# EAGLE design motor_module_dev (EAGLE 6.5.0)
AUTHOR: Austin Buchan; DESIGN_NAME: MotorModule; REVISION: 0.0; YEAR: 2014

## Sheet 1 of 3: Power
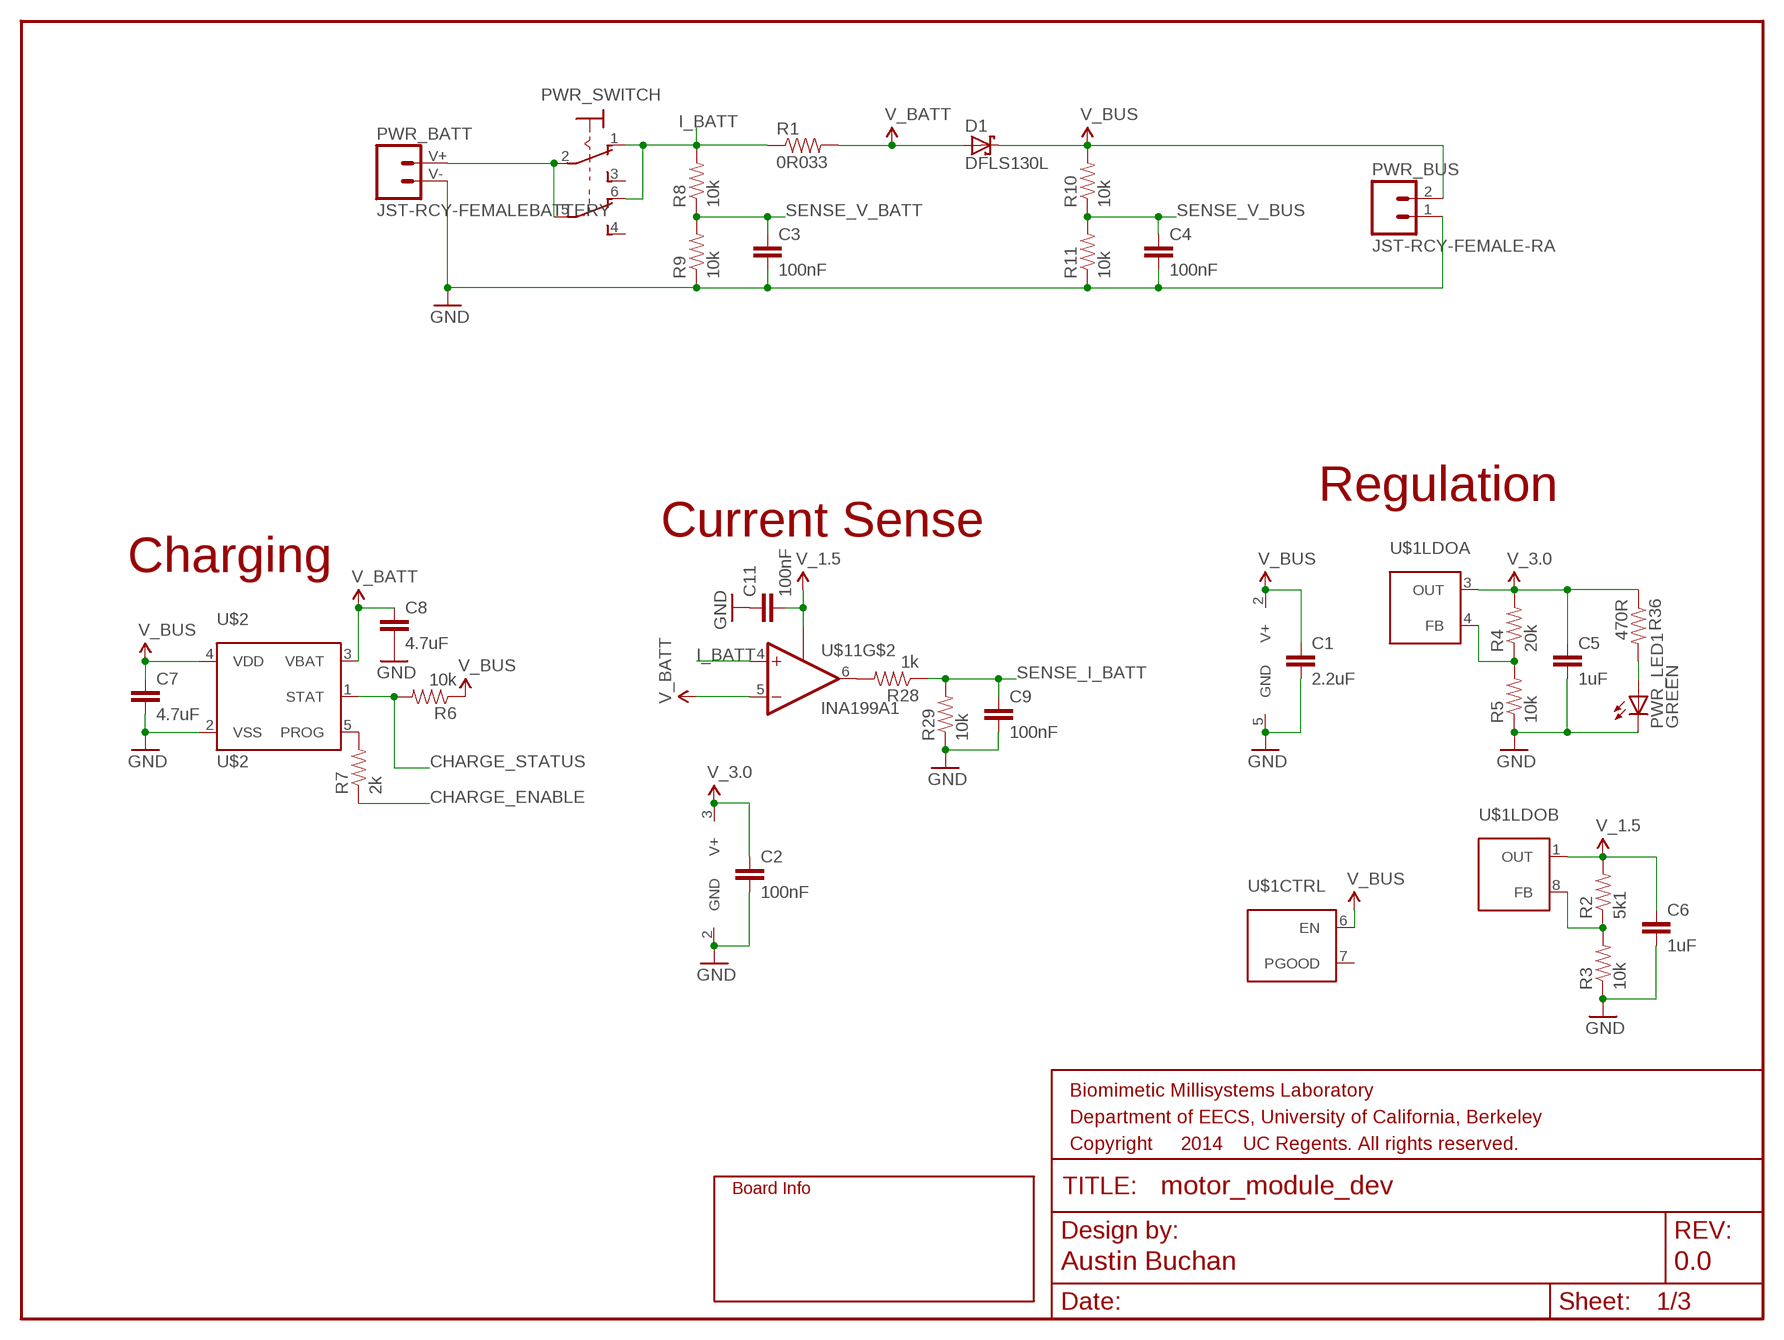
[diagram p0: schematic, sheet 1]
FRAME1 (FRAME-LETTER): SHEET_NAME: Power

### Parts
C1  2.2uF  CAP0402-CAP  [0402-CAP]
C2  100nF  CAP0402-CAP  [0402-CAP]
C3  100nF  CAP0402-CAP  [0402-CAP]
C4  100nF  CAP0402-CAP  [0402-CAP]
C5  1uF  CAP0402-CAP  [0402-CAP]
C6  1uF  CAP0402-CAP  [0402-CAP]
C7  4.7uF  CAP0402-CAP  [0402-CAP]
C8  4.7uF  CAP0402-CAP  [0402-CAP]
C9  100nF  CAP0402-CAP  [0402-CAP]
C11  100nF  CAP0402-CAP  [0402-CAP]
D1  DFLS130L  [POWERDI123]
PWR_BATT  JST-RCY-FEMALEBATTERY  [TP_LIPO_160MAH]
PWR_BUS  JST-RCY-FEMALE-RA  [JST_2_FEMALE]
PWR_LED1  GREEN  LED0603  [LED-0603]
PWR_SWITCH  JS202011SCQN  [JS202011SCQN]
R1  0R033  RESISTOR0603-RES  [0603-RES]
R2  5k1  RESISTOR0402-RES  [0402-RES]
R3  10k  RESISTOR0402-RES  [0402-RES]
R4  20k  RESISTOR0402-RES  [0402-RES]
R5  10k  RESISTOR0402-RES  [0402-RES]
R6  10k  RESISTOR0402-RES  [0402-RES]
R7  2k  RESISTOR0402-RES  [0402-RES]
R8  10k  RESISTOR0402-RES  [0402-RES]
R9  10k  RESISTOR0402-RES  [0402-RES]
R10  10k  RESISTOR0402-RES  [0402-RES]
R11  10k  RESISTOR0402-RES  [0402-RES]
R28  1k  RESISTOR0402-RES  [0402-RES]
R29  10k  RESISTOR0402-RES  [0402-RES]
R36  470R  RESISTOR0402-RES  [0402-RES]
U$1  SC560C  [MLPQ-UT8]
U$2  MCP73831T  [SOT23-5]
U$11  INA199A1  [SC70-6]
U$31  INFO  [INFO]

### Nets
CHARGE_ENABLE: R7.1 ; also sheet 3
CHARGE_STATUS: R6.2 U$2.1(STAT) ; also sheet 3
GND: C1.2 C2.2 C3.2 C4.2 C5.2 C6.2 C7.2 C8.2 C9.2 C11.1 PWR_BATT.V- PWR_BUS.1 PWR_LED1.C R3.1 R5.1 R9.1 R11.1 R29.1 U$1.5(GND) U$2.2(VSS) U$11.2(GND) ; also sheet 2,3
I_BATT: PWR_SWITCH.1(O) PWR_SWITCH.6(O) R1.1 R8.2 U$11.4(+IN)
N$1: PWR_BATT.V+ PWR_SWITCH.2(P) PWR_SWITCH.5(P)
N$2: R2.1 R3.2 U$1.8(LDOB:FB)
N$3: R4.1 R5.2 U$1.4(LDOA:FB)
N$4: R7.2 U$2.5(PROG)
N$6: R28.2 U$11.6(OUT)
N$7: PWR_LED1.A R36.2
SENSE_I_BATT: C9.1 R28.1 R29.2 ; also sheet 3
SENSE_V_BATT: C3.1 R8.1 R9.2 ; also sheet 3
SENSE_V_BUS: C4.1 R10.1 R11.2 ; also sheet 3
V_1.5: C6.1 C11.2 R2.2 U$1.1(LDOB:OUT) U$11.1(REF) ; also sheet 2
V_3.0: C2.1 C5.1 R4.2 R36.1 U$1.3(LDOA:OUT) U$11.3(V+) ; also sheet 2,3
V_BATT: C8.1 D1.A R1.2 U$2.3(VBAT) U$11.5(-IN) ; also sheet 2
V_BUS: C1.1 C7.1 D1.C PWR_BUS.2 R6.1 R10.2 U$1.2(V+) U$1.6(CTRL:EN) U$2.4(VDD) ; also sheet 3
Unconnected: PWR_SWITCH.3(S) PWR_SWITCH.4(S) U$1.7(CTRL:PGOOD)

### Notes on the sheet
- Regulation
- Current Sense
- Charging

## Sheet 2 of 3: Motor
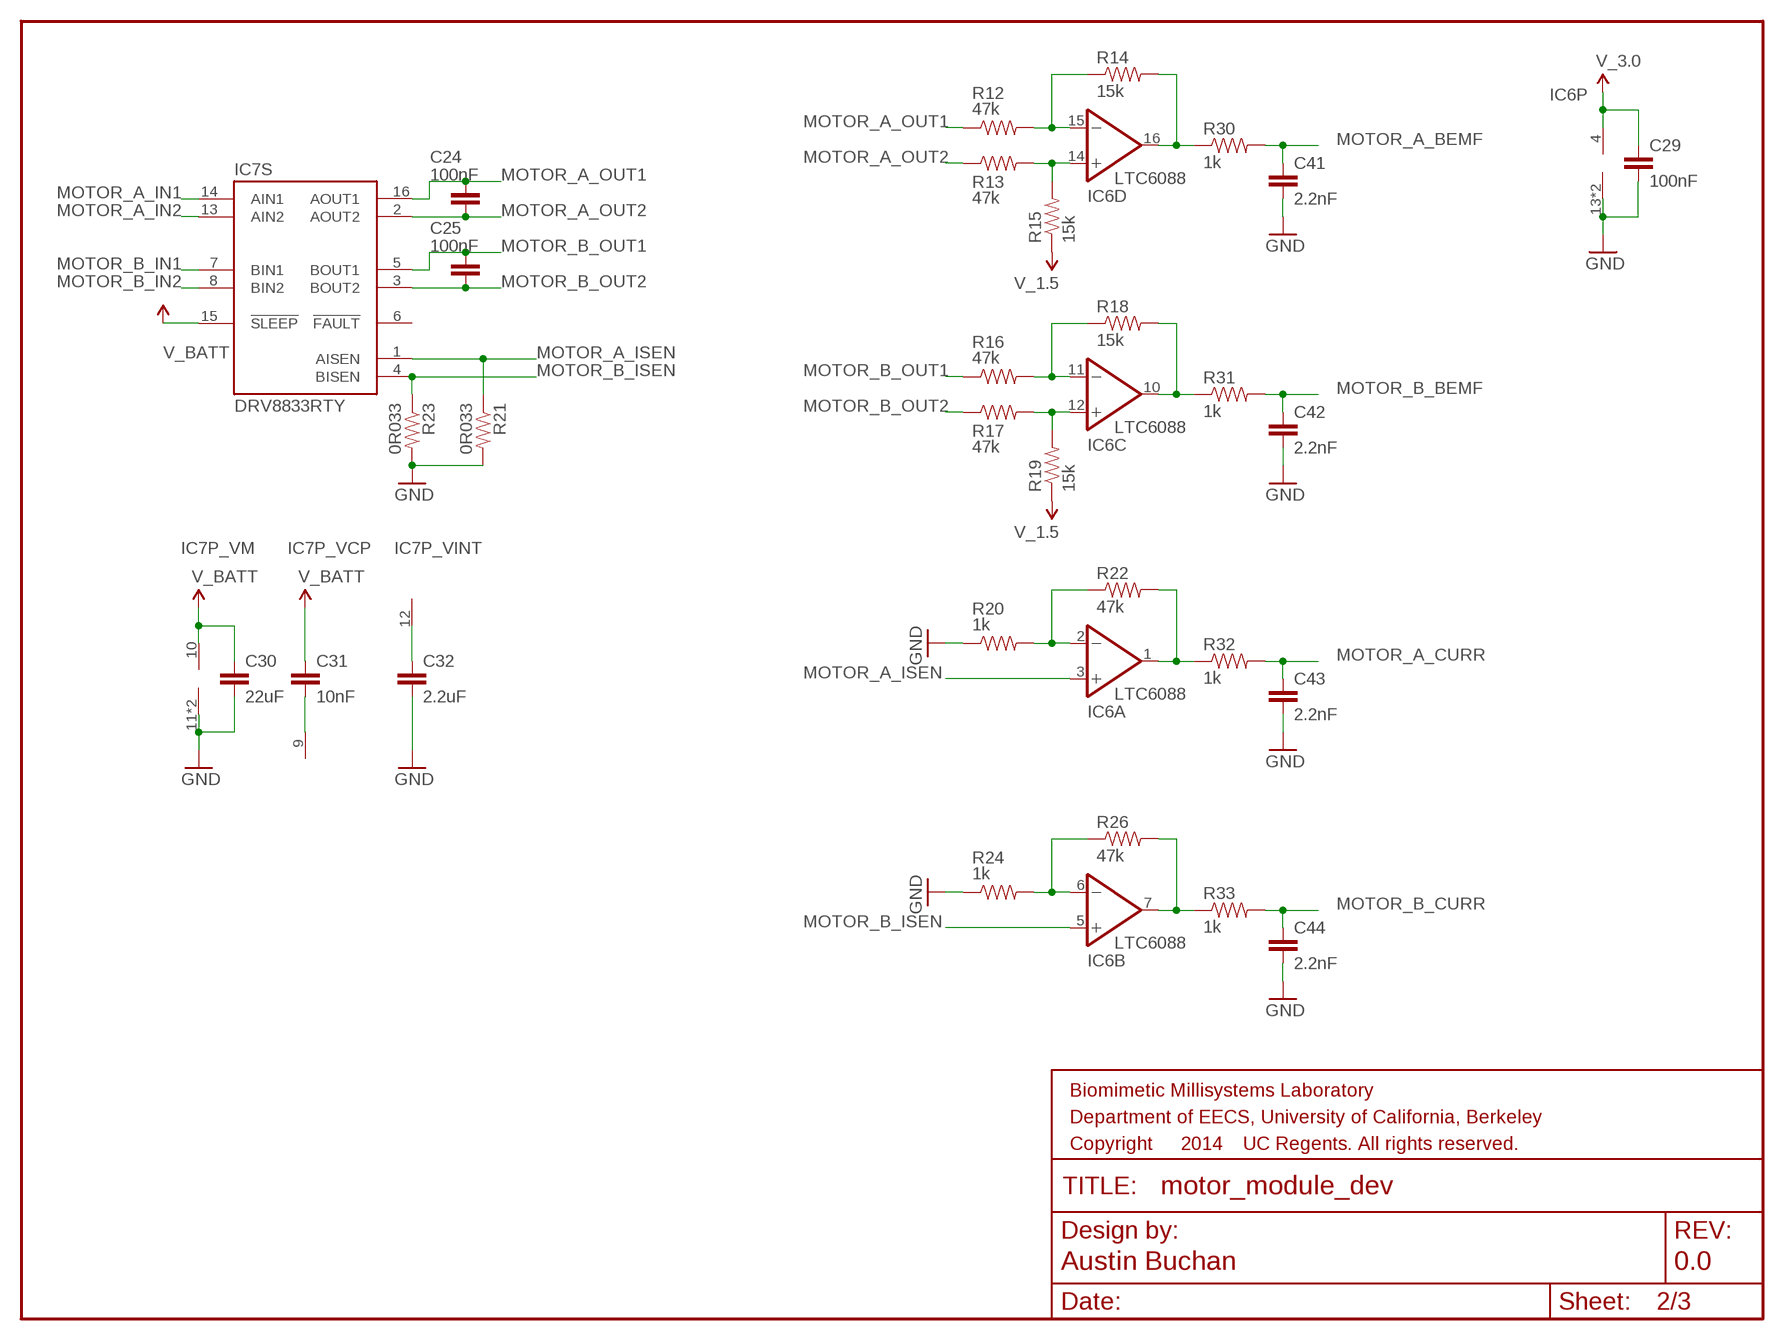
[diagram p1: schematic, sheet 2]
FRAME3 (FRAME-LETTER): SHEET_NAME: Motor

### Parts
C24  100nF  CAP0402-CAP  [0402-CAP]
C25  100nF  CAP0402-CAP  [0402-CAP]
C29  100nF  CAP0402-CAP  [0402-CAP]
C30  22uF  CAP0603-CAP  [0603-CAP]
C31  10nF  CAP0402-CAP  [0402-CAP]
C32  2.2uF  CAP0402-CAP  [0402-CAP]
C41  2.2nF  CAP0402-CAP  [0402-CAP]
C42  2.2nF  CAP0402-CAP  [0402-CAP]
C43  2.2nF  CAP0402-CAP  [0402-CAP]
C44  2.2nF  CAP0402-CAP  [0402-CAP]
IC6  LTC6088  [DFN-16]
IC7  DRV8833RTY  [S-PWQFN-N16]
R12  47k  RESISTOR0402-RES  [0402-RES]
R13  47k  RESISTOR0402-RES  [0402-RES]
R14  15k  RESISTOR0402-RES  [0402-RES]
R15  15k  RESISTOR0402-RES  [0402-RES]
R16  47k  RESISTOR0402-RES  [0402-RES]
R17  47k  RESISTOR0402-RES  [0402-RES]
R18  15k  RESISTOR0402-RES  [0402-RES]
R19  15k  RESISTOR0402-RES  [0402-RES]
R20  1k  RESISTOR0402-RES  [0402-RES]
R21  0R033  RESISTOR0603-RES  [0603-RES]
R22  47k  RESISTOR0402-RES  [0402-RES]
R23  0R033  RESISTOR0603-RES  [0603-RES]
R24  1k  RESISTOR0402-RES  [0402-RES]
R26  47k  RESISTOR0402-RES  [0402-RES]
R30  1k  RESISTOR0402-RES  [0402-RES]
R31  1k  RESISTOR0402-RES  [0402-RES]
R32  1k  RESISTOR0402-RES  [0402-RES]
R33  1k  RESISTOR0402-RES  [0402-RES]

### Nets
GND: C29.2 C30.2 C32.2 C41.2 C42.2 C43.2 C44.2 IC6.13(P:V-) IC6.PAD(P:V-) IC7.11(P_VM:V-) IC7.PPAD(P_VM:V-) R20.1 R21.2 R23.2 R24.1 ; also sheet 1,3
MOTOR_A_BEMF: C41.1 R30.2 ; also sheet 3
MOTOR_A_CURR: C43.1 R32.2 ; also sheet 3
MOTOR_A_IN1: IC7.14(S:AIN1) ; also sheet 3
MOTOR_A_IN2: IC7.13(S:AIN2) ; also sheet 3
MOTOR_A_ISEN: IC6.3(A:+IN) IC7.1(S:AISEN) R21.1
MOTOR_A_OUT1: C24.1 IC7.16(S:AOUT1) R12.1
MOTOR_A_OUT2: C24.2 IC7.2(S:AOUT2) R13.1
MOTOR_B_BEMF: C42.1 R31.2 ; also sheet 3
MOTOR_B_CURR: C44.1 R33.2 ; also sheet 3
MOTOR_B_IN1: IC7.7(S:BIN1) ; also sheet 3
MOTOR_B_IN2: IC7.8(S:BIN2) ; also sheet 3
MOTOR_B_ISEN: IC6.5(B:+IN) IC7.4(S:BISEN) R23.1
MOTOR_B_OUT1: C25.1 IC7.5(S:BOUT1) R16.1
MOTOR_B_OUT2: C25.2 IC7.3(S:BOUT2) R17.1
N$5: C31.2 IC7.9(P_VCP:V+)
N$18: C32.1 IC7.12(P_VINT:V-)
N$22: IC6.11(C:-IN) R16.2 R18.1
N$23: IC6.12(C:+IN) R17.2 R19.2
N$24: IC6.2(A:-IN) R20.2 R22.1
N$26: IC6.6(B:-IN) R24.2 R26.1
N$30: IC6.15(D:-IN) R12.2 R14.1
N$31: IC6.14(D:+IN) R13.2 R15.2
N$34: IC6.7(B:OUT) R26.2 R33.1
N$35: IC6.1(A:OUT) R22.2 R32.1
N$36: IC6.16(D:OUT) R14.2 R30.1
N$37: IC6.10(C:OUT) R18.2 R31.1
V_1.5: R15.1 R19.1 ; also sheet 1
V_3.0: C29.1 IC6.4(P:V+) ; also sheet 1,3
V_BATT: C30.1 C31.1 IC7.10(P_VM:V+) IC7.15(S:!SLEEP) ; also sheet 1
Unconnected: IC7.6(S:!FAULT)

## Sheet 3 of 3: Microcontroller
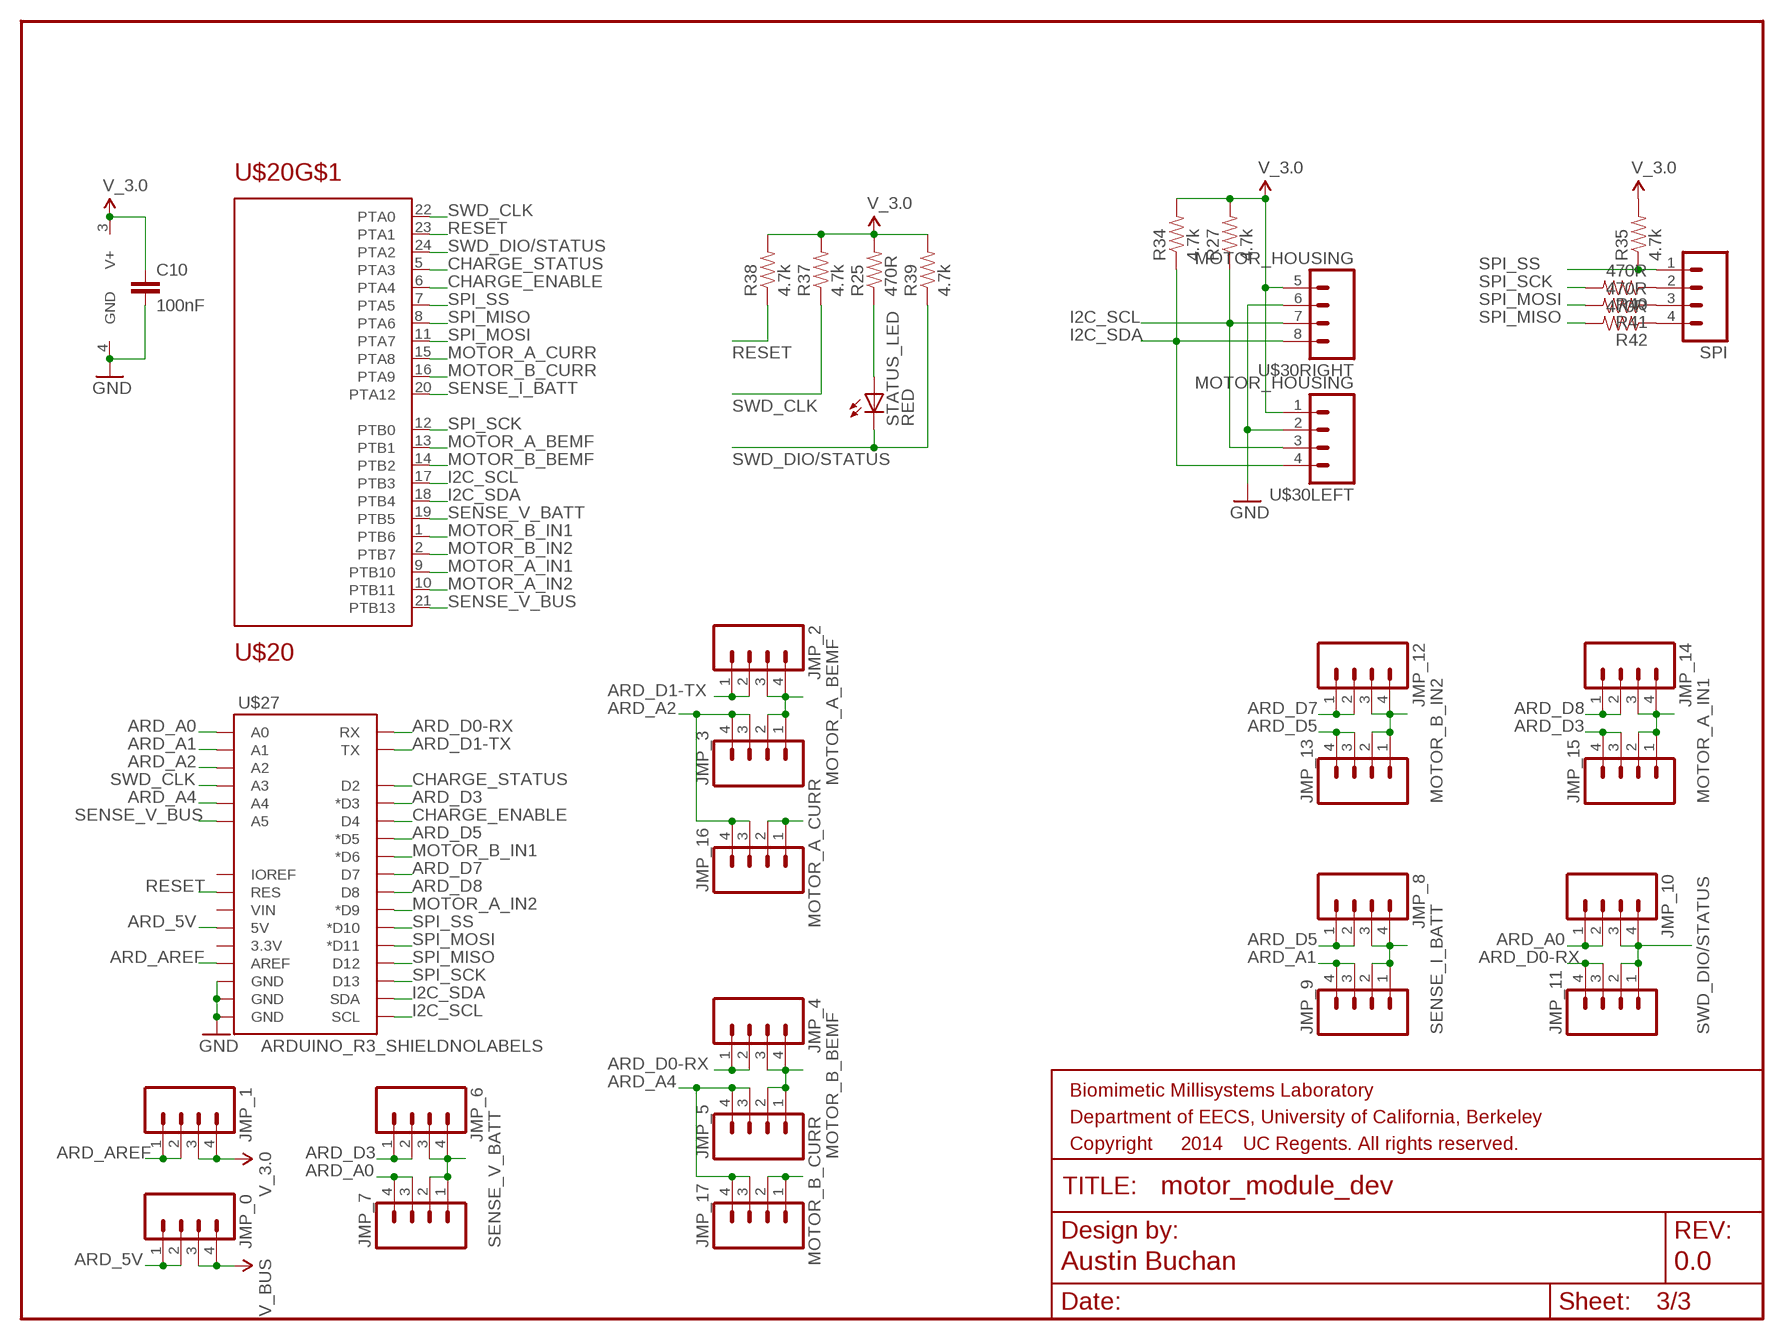
[diagram p2: schematic, sheet 3]

### Parts
C10  100nF  CAP0402-CAP  [0402-CAP]
JMP_0  M041X04_NO_SILK  [1X04_NO_SILK]
JMP_1  M041X04_NO_SILK  [1X04_NO_SILK]
JMP_2  M041X04_NO_SILK  [1X04_NO_SILK]
JMP_3  M041X04_NO_SILK  [1X04_NO_SILK]
JMP_4  M041X04_NO_SILK  [1X04_NO_SILK]
JMP_5  M041X04_NO_SILK  [1X04_NO_SILK]
JMP_6  M041X04_NO_SILK  [1X04_NO_SILK]
JMP_7  M041X04_NO_SILK  [1X04_NO_SILK]
JMP_8  M041X04_NO_SILK  [1X04_NO_SILK]
JMP_9  M041X04_NO_SILK  [1X04_NO_SILK]
JMP_10  M041X04_NO_SILK  [1X04_NO_SILK]
JMP_11  M041X04_NO_SILK  [1X04_NO_SILK]
JMP_12  M041X04_NO_SILK  [1X04_NO_SILK]
JMP_13  M041X04_NO_SILK  [1X04_NO_SILK]
JMP_14  M041X04_NO_SILK  [1X04_NO_SILK]
JMP_15  M041X04_NO_SILK  [1X04_NO_SILK]
JMP_16  M041X04_NO_SILK  [1X04_NO_SILK]
JMP_17  M041X04_NO_SILK  [1X04_NO_SILK]
R25  470R  RESISTOR0402-RES  [0402-RES]
R27  4.7k  RESISTOR0402-RES  [0402-RES]
R34  4.7k  RESISTOR0402-RES  [0402-RES]
R35  4.7k  RESISTOR0402-RES  [0402-RES]
R37  4.7k  RESISTOR0402-RES  [0402-RES]
R38  4.7k  RESISTOR0402-RES  [0402-RES]
R39  4.7k  RESISTOR0402-RES  [0402-RES]
R40  470R  RESISTOR0402-RES  [0402-RES]
R41  470R  RESISTOR0402-RES  [0402-RES]
R42  470R  RESISTOR0402-RES  [0402-RES]
SPI  M041X04_NO_SILK  [1X04_NO_SILK]
STATUS_LED  RED  LED0603  [LED-0603]
U$20  MKL05Z32VFK4  [QFN-24]
U$27  ARDUINO_R3_SHIELDNOLABELS  [UNO_R3_SHIELD_NOLABELS]
U$30  MOTOR_HOUSING  [MOTOR_HOUSING]

### Nets
ARD_5V: JMP_0.1 JMP_0.2 U$27.5V
ARD_A0: JMP_7.3 JMP_7.4 JMP_10.1 JMP_10.2 U$27.A0
ARD_A1: JMP_9.3 JMP_9.4 U$27.A1
ARD_A2: JMP_3.3 JMP_3.4 JMP_16.3 JMP_16.4 U$27.A2
ARD_A4: JMP_5.3 JMP_5.4 JMP_17.3 JMP_17.4 U$27.A4
ARD_AREF: JMP_1.1 JMP_1.2 U$27.AREF
ARD_D0-RX: JMP_4.1 JMP_4.2 JMP_11.3 JMP_11.4 U$27.RX
ARD_D1-TX: JMP_2.1 JMP_2.2 U$27.TX
ARD_D3: JMP_6.1 JMP_6.2 JMP_15.3 JMP_15.4 U$27.D3(*D3)
ARD_D5: JMP_8.1 JMP_8.2 JMP_13.3 JMP_13.4 U$27.D5(*D5)
ARD_D7: JMP_12.1 JMP_12.2 U$27.D7
ARD_D8: JMP_14.1 JMP_14.2 U$27.D8
CHARGE_ENABLE: U$20.6(PTA4) U$27.D4 ; also sheet 1
CHARGE_STATUS: U$20.5(PTA3) U$27.D2 ; also sheet 1
GND: C10.2 U$20.4(GND) U$27.GND@0(GND) U$27.GND@1(GND) U$27.GND@2(GND) U$30.2 U$30.6 ; also sheet 1,2
I2C_SCL: R27.1 U$20.17(PTB3) U$27.SCL U$30.3 U$30.7
I2C_SDA: R34.1 U$20.18(PTB4) U$27.SDA U$30.4 U$30.8
MOTOR_A_BEMF: JMP_2.3 JMP_2.4 JMP_3.1 JMP_3.2 U$20.13(PTB1) ; also sheet 2
MOTOR_A_CURR: JMP_16.1 JMP_16.2 U$20.15(PTA8) ; also sheet 2
MOTOR_A_IN1: JMP_14.3 JMP_14.4 JMP_15.1 JMP_15.2 U$20.9(PTB10) ; also sheet 2
MOTOR_A_IN2: U$20.10(PTB11) U$27.D9(*D9) ; also sheet 2
MOTOR_B_BEMF: JMP_4.3 JMP_4.4 JMP_5.1 JMP_5.2 U$20.14(PTB2) ; also sheet 2
MOTOR_B_CURR: JMP_17.1 JMP_17.2 U$20.16(PTA9) ; also sheet 2
MOTOR_B_IN1: U$20.1(PTB6) U$27.D6(*D6) ; also sheet 2
MOTOR_B_IN2: JMP_12.3 JMP_12.4 JMP_13.1 JMP_13.2 U$20.2(PTB7) ; also sheet 2
N$8: R25.1 STATUS_LED.A
N$9: R40.1 SPI.2
N$10: R41.1 SPI.3
N$11: R42.1 SPI.4
RESET: R38.1 U$20.23(PTA1) U$27.RES
SENSE_I_BATT: JMP_8.3 JMP_8.4 JMP_9.1 JMP_9.2 U$20.20(PTA12) ; also sheet 1
SENSE_V_BATT: JMP_6.3 JMP_6.4 JMP_7.1 JMP_7.2 U$20.19(PTB5) ; also sheet 1
SENSE_V_BUS: U$20.21(PTB13) U$27.A5 ; also sheet 1
SPI_MISO: R42.2 U$20.8(PTA6) U$27.D12
SPI_MOSI: R41.2 U$20.11(PTA7) U$27.D11(*D11)
SPI_SCK: R40.2 U$20.12(PTB0) U$27.D13
SPI_SS: R35.1 SPI.1 U$20.7(PTA5) U$27.D10(*D10)
SWD_CLK: R37.1 U$20.22(PTA0) U$27.A3
SWD_DIO/STATUS: JMP_10.3 JMP_10.4 JMP_11.1 JMP_11.2 R39.1 STATUS_LED.C U$20.24(PTA2)
V_3.0: C10.1 JMP_1.3 JMP_1.4 R25.2 R27.2 R34.2 R35.2 R37.2 R38.2 R39.2 U$20.3(V+) U$30.1 U$30.5 ; also sheet 1,2
V_BUS: JMP_0.3 JMP_0.4 ; also sheet 1
Unconnected: U$27.3.3V U$27.IOREF U$27.VIN

## Library data of the parts
C1 C7 C8 C30 = biomimetic:CAP: Capacitor Standard 0603 ceramic capacitor, and 0.1" leaded capacitor.; VOLTAGE: 10V
C2-C6 C9-C11 C29 C41-C44 = biomimetic:CAP: Capacitor Standard 0603 ceramic capacitor, and 0.1" leaded capacitor.; VOLTAGE: 6.3V
C24 C25 = biomimetic:CAP: Capacitor Standard 0603 ceramic capacitor, and 0.1" leaded capacitor.; TECHNOLOGY: CERAMIC; VOLTAGE: 10V
C31 = biomimetic:CAP: Capacitor Standard 0603 ceramic capacitor, and 0.1" leaded capacitor.; DIELECTRIC: X7R; TECHNOLOGY: CERAMIC; VOLTAGE: 16V
C32 = biomimetic:CAP: Capacitor Standard 0603 ceramic capacitor, and 0.1" leaded capacitor.; TECHNOLOGY: CERAMIC; VOLTAGE: 6.3V
D1 = modular_robotics:DFLS130L
IC6 = biomimetic:LTC6088: 14MHz, Rail-to-Rail Output, 12nV/Hz, 1.1mA Op Amp Source: http://cds.linear.com/docs/Datasheet/60878fb.pdf Digi-Key P/N: LTC6088HDHC#PBF-ND
IC7 = biomimetic:DRV8833: TI DRV8833 1.5A Dual H-Bridge Motor Driver IC Digi-Key P/N: 296-29513-6-ND
JMP_0 JMP_1-JMP_17 SPI = modular_robotics:M04: Header 4 Standard 4-pin 0.1" header. Use with straight break away headers (SKU : PRT-00116), right angle break away headers (PRT-00553), swiss pins (PRT-00743), machine pins (PRT-00117), and female headers (PRT-00115). Molex polarized connector foot print use with SKU : PRT-08231 with associated crimp pins and housings. 1MM SMD Version SKU: PRT-10208
PWR_BATT PWR_BUS = modular_robotics:JST-RCY-FEMALE
PWR_LED1 STATUS_LED = biomimetic:LED: LEDs Standard schematic elements and footprints for 5mm, 3mm, 1206, and 0603 sized LEDs. 5mm - Spark Fun Electronics SKU : COM-00529 (and others)
PWR_SWITCH = modular_robotics:JS202011SCQN
R1-R11 R21 R23 R25 R27-R42 = biomimetic:RESISTOR: Resistor Basic schematic elements and footprints for 0603, 1206, and PTH resistors.
R12-R20 R22 R24 R26 = biomimetic:RESISTOR: Resistor Basic schematic elements and footprints for 0603, 1206, and PTH resistors.; TOLERANCE: 1%
U$1 = modular_robotics:SC560C
U$2 = modular_robotics:MCP73831T
U$11 = modular_robotics:INA199A1
U$20 = modular_robotics:MKL05Z32VFK4
U$27 = SparkFun-Boards:ARDUINO_R3_SHIELD: Shield form compatible with the Arduino Uno R3.
U$30 = modular_robotics:MOTOR_HOUSING
U$31 = modular_robotics:INFO; AUTHOR: Austin Buchan; DATE: Feb. 2014; DESIGN: Motor Control Dev; ORGANIZATION: UC Berkeley Biomimetic Millisystems Lab; REVISION: r0.1

## Board
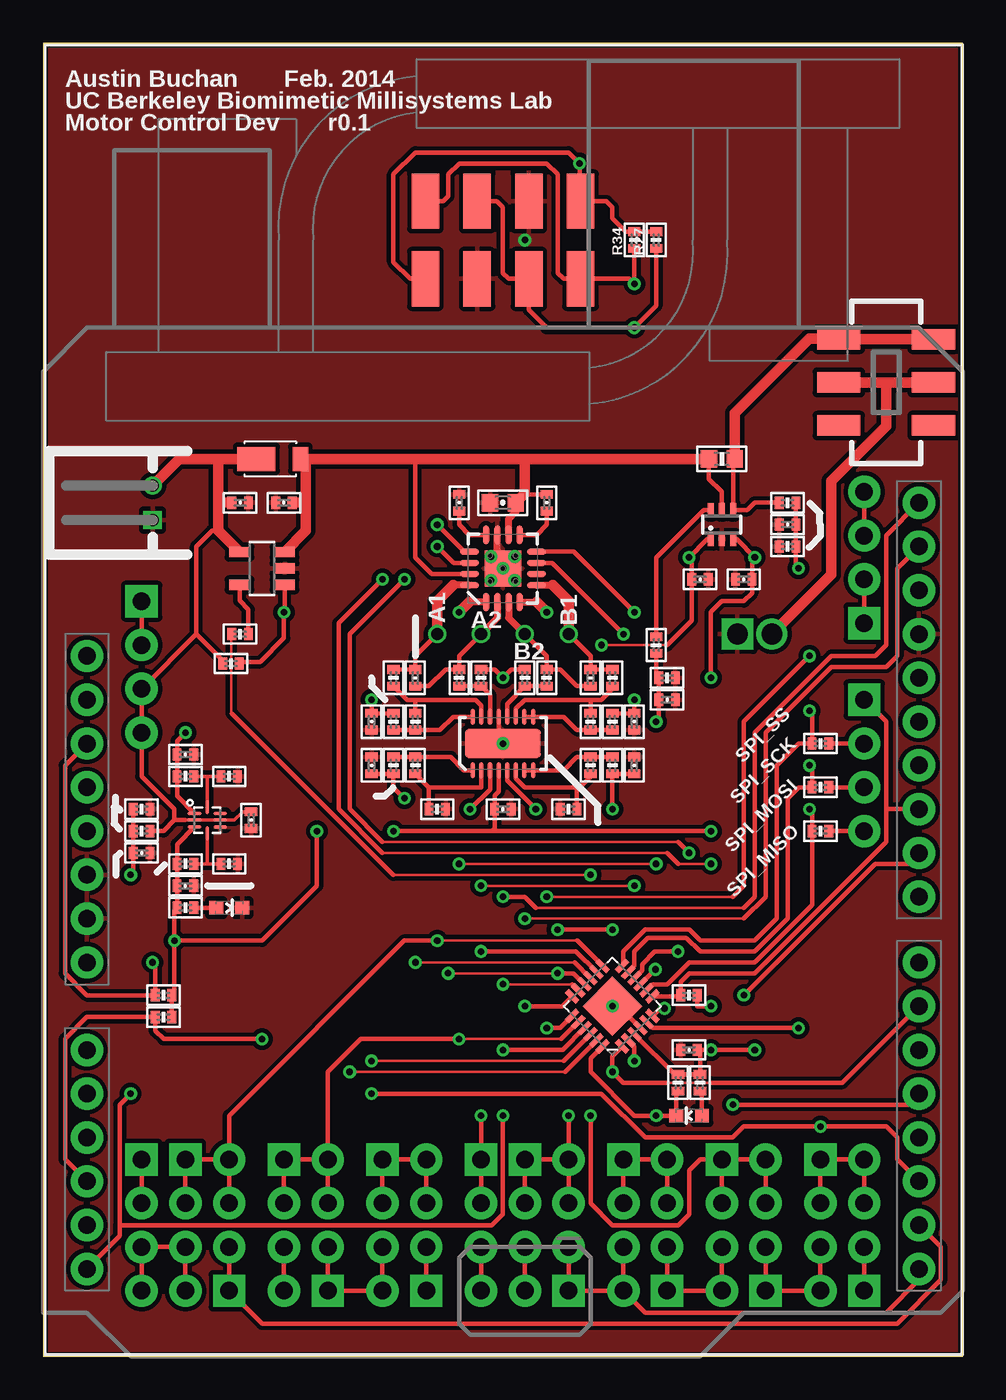
[diagram p3: board, top side]
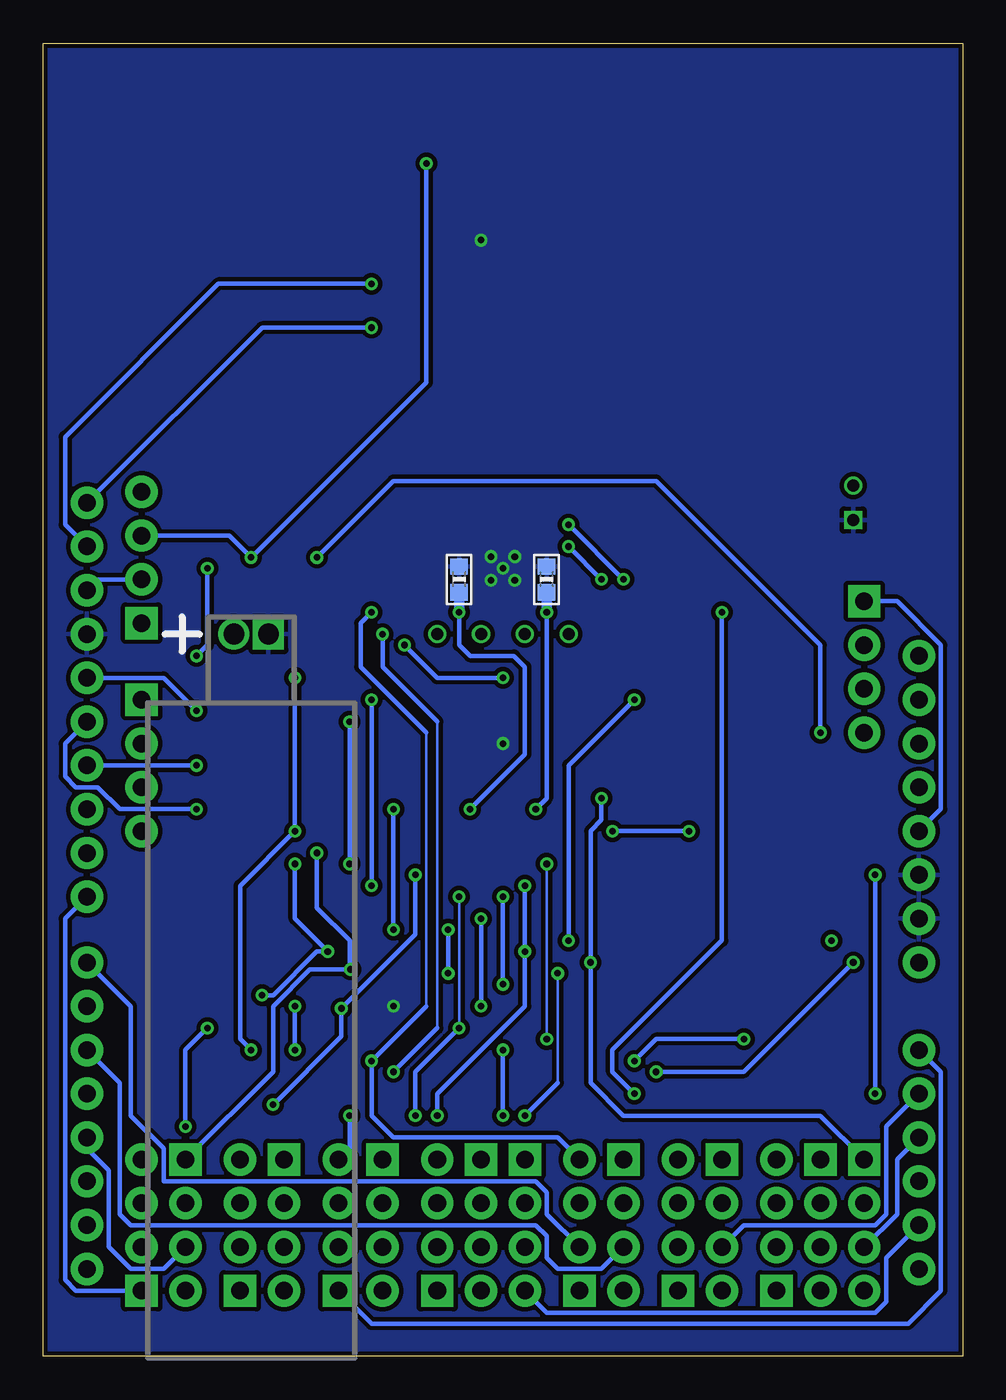
[diagram p4: board, bottom side, seen from below]

Size 53.34 x 76.2 mm. Coordinates in mm from the lower left corner, seen from the top.
Outline: 0,0 53.34,0 53.34,76.2 0,76.2 0,0
Copper layers (1*2+3*16): Top 2mil / dielectric 9mil / Route2 2mil / dielectric 40mil / Route3 2mil / dielectric 9mil / Bottom 2mil
Design rules "advancedcircuits-66each-biomimetic": minimum track width 6mil, minimum drill 15mil, track to track 6mil, track to pad 6mil, pad to pad 6mil, via to via 6mil, smd to smd 6mil, copper to edge 10mil, drill to drill 7mil, minimum pad ring 7mil, minimum via ring 7mil, stop-mask expansion 3mil, vias tented up to drill 0mil, thermal gap 10mil

### Footprints (pad centres in the part's own frame; a part is rotated, then mirrored left to right if it is on the bottom)
0402-CAP = smd 0.508 x 0.711: 1 -0.483,0; 2 0.483,0
0603-CAP = smd 0.94 x 1.016: 1 -0.749,0; 2 0.749,0
POWERDI123 = smd 0.9 x 1.4: A 0.95,0 | smd 2.2 x 1.4: C -1.6,0
DFN-16 = smd 0.25 x 0.9: 1 -1.75,-1.55; 2 -1.25,-1.55; 3 -0.75,-1.55; 4 -0.25,-1.55; 5 0.25,-1.55; 6 0.75,-1.55; 7 1.25,-1.55; 8 1.75,-1.55; 9 1.75,1.55; 10 1.25,1.55; 11 0.75,1.55; 12 0.25,1.55; 13 -0.25,1.55; 14 -0.75,1.55; 15 -1.25,1.55; 16 -1.75,1.55 | smd 4.4 x 1.65: PAD 0,0
S-PWQFN-N16 = smd 1.1 x 0.35: 1 -1.95,0.975; 2 -1.95,0.325; 3 -1.95,-0.325; 4 -1.95,-0.975; 9 1.95,-0.975; 10 1.95,-0.325; 11 1.95,0.325; 12 1.95,0.975 | smd 0.35 x 1.1: 5 -0.975,-1.95; 6 -0.325,-1.95; 7 0.325,-1.95; 8 0.975,-1.95; 13 0.975,1.95; 14 0.325,1.95; 15 -0.325,1.95; 16 -0.975,1.95 | smd 2.1 x 2.1: PPAD 0,0
1X04_NO_SILK = drill 1.016 pad 1.88 square: 1 0,0 | drill 1.016 pad 1.88: 2 2.54,0; 3 5.08,0; 4 7.62,0
TP_LIPO_160MAH = drill 1.2 pad 1.6: V+ -1,0 | drill 1.2 pad 1.6 square: V- 1,0
JST_2_FEMALE = drill 0.7 square: 1 -1,0 | drill 0.7: 2 1,0
LED-0603 = smd 0.8 x 0.8: A 0,-0.75; C 0,0.75
JS202011SCQN = smd 1.2 x 2.5: 1 -2.5,-2.75; 2 0,-2.75; 3 2.5,-2.75; 4 2.5,2.75; 5 0,2.75; 6 -2.5,2.75
0603-RES = smd 0.94 x 1.016: 1 -0.749,0; 2 0.749,0
0402-RES = smd 0.508 x 0.711: 1 -0.483,0; 2 0.483,0
MLPQ-UT8 = smd 0.8 x 0.2: 1 -0.75,0.4; 2 -0.75,0; 3 -0.75,-0.4; 5 0.75,-0.4; 6 0.75,0; 7 0.75,0.4 | smd 0.2 x 0.8: 4 0,-0.75; 8 0,0.75
SOT23-5 = smd 0.6 x 1.2: 1 -0.95,-1.306; 2 0,-1.306; 3 0.95,-1.306; 4 0.95,1.306; 5 -0.95,1.306
SC70-6 = smd 0.35 x 0.8: 1 -0.65,-0.85; 2 0,-0.85; 3 0.65,-0.85; 4 0.65,0.85; 5 0,0.85; 6 -0.65,0.85
QFN-24 = smd 0.9 x 0.3: 1 -2.05,1.25; 2 -2.05,0.75; 3 -2.05,0.25; 4 -2.05,-0.25; 5 -2.05,-0.75; 6 -2.05,-1.25; 13 2.05,-1.25; 14 2.05,-0.75; 15 2.05,-0.25; 16 2.05,0.25; 17 2.05,0.75; 18 2.05,1.25 | smd 0.3 x 0.9: 7 -1.25,-2.05; 8 -0.75,-2.05; 9 -0.25,-2.05; 10 0.25,-2.05; 11 0.75,-2.05; 12 1.25,-2.05; 19 1.25,2.05; 20 0.75,2.05; 21 0.25,2.05; 22 -0.25,2.05; 23 -0.75,2.05; 24 -1.25,2.05 | smd 2.45 x 2.45: EP 0,0
UNO_R3_SHIELD_NOLABELS = drill 1.016 pad 1.88: 3.3V 50.8,26.67; 5V 50.8,29.21; A0 50.8,41.91; A1 50.8,44.45; A2 50.8,46.99; A3 50.8,49.53; A4 50.8,52.07; A5 50.8,54.61; AREF 2.54,15.24; D2 2.54,49.53; D3 2.54,46.99; D4 2.54,44.45; D5 2.54,41.91; D6 2.54,39.37; D7 2.54,36.83; D8 2.54,33.02; D9 2.54,30.48; D10 2.54,27.94; D11 2.54,25.4; D12 2.54,22.86; D13 2.54,20.32; GND@0 50.8,31.75; GND@1 50.8,34.29; GND@2 2.54,17.78; IOREF 50.8,21.59; NC 50.8,19.05; RES 50.8,24.13; RX 2.54,54.61; SCL 2.54,10.16; SDA 2.54,12.7; TX 2.54,52.07; VIN 50.8,36.83
MOTOR_HOUSING = smd 1.6 x 3.2: 1 -4.5,-2.25; 2 -1.5,-2.25; 3 1.5,-2.25; 4 4.5,-2.25; 5 4.5,2.25; 6 1.5,2.25; 7 -1.5,2.25; 8 -4.5,2.25

### Placement (x,y rotation side)
C1  12.06,31.11 270 top
C2  40.64,45.09 180 top
C3  43.18,48.26 180 top
C4  5.71,29.21 0 top
C5  8.26,27.3 0 top
C6  8.26,34.92 0 top
C7  11.43,49.53 0 top
C8  13.97,49.53 180 top
C9  36.2,38.1 0 top
C10  37.47,17.78 180 top
C11  38.1,45.09 180 top
C24  21.59,39.37 270 top
C25  31.75,39.37 270 top
C29  26.67,31.75 0 top
C30  26.67,49.53 180 top
C31  29.21,49.53 270 top
C32  24.13,49.53 90 top
C41  19.05,36.83 270 top
C42  34.29,36.83 270 top
C43  19.05,34.29 90 top
C44  34.29,34.29 90 top
D1  13.97,52.07 0 top
IC6  26.67,35.56 0 top
IC7  26.67,45.72 90 top
JMP_0  5.71,43.81 270 top
JMP_1  47.62,42.55 90 top
JMP_2  10.79,3.81 90 top
JMP_3  8.26,11.43 270 top
JMP_4  30.48,3.81 90 top
JMP_5  27.94,11.43 270 top
JMP_6  41.91,3.81 90 top
JMP_7  39.37,11.43 270 top
JMP_8  16.51,3.81 90 top
JMP_9  13.97,11.43 270 top
JMP_10  36.2,3.81 90 top
JMP_11  33.66,11.43 270 top
JMP_12  22.23,3.81 90 top
JMP_13  19.68,11.43 270 top
JMP_14  47.62,3.81 90 top
JMP_15  45.09,11.43 270 top
JMP_16  5.71,11.43 270 top
JMP_17  25.4,11.43 270 top
PWR_BATT  41.27,41.91 0 bottom
PWR_BUS  6.35,49.53 90 top
PWR_LED1  10.79,26.04 270 top
PWR_SWITCH  48.9,56.52 270 top
R1  39.37,52.07 180 top
R2  8.26,33.66 180 top
R3  10.79,33.66 180 top
R4  8.26,28.57 180 top
R5  10.79,28.57 180 top
R6  10.9,40.2 0 top
R7  11.43,41.91 0 top
R8  43.18,49.53 180 top
R9  43.18,46.99 0 top
R10  5.71,30.48 0 top
R11  5.71,31.75 180 top
R12  20.32,39.37 270 top
R13  24.13,39.37 270 top
R14  21.59,36.83 270 top
R15  25.4,39.37 270 top
R16  33.02,39.37 270 top
R17  29.21,39.37 270 top
R18  31.75,36.83 270 top
R19  27.94,39.37 270 top
R20  22.86,31.75 180 top
R21  24.13,45.09 90 bottom
R22  21.59,34.29 90 top
R23  29.21,45.09 90 bottom
R24  30.48,31.75 0 top
R25  38.1,15.88 90 top
R26  31.75,34.29 90 top
R27  35.56,64.77 90 top
R28  35.56,41.27 90 top
R29  36.2,39.37 180 top
R30  20.32,36.83 90 top
R31  33.02,36.83 90 top
R32  20.32,34.29 270 top
R33  33.02,34.29 270 top
R34  34.29,64.77 90 top
R35  37.47,20.95 0 top
R36  8.26,26.04 0 top
R37  6.99,19.68 0 top
R38  6.99,20.95 0 top
R39  36.83,15.88 90 top
R40  45.09,35.56 180 top
R41  45.09,33.02 180 top
R42  45.09,30.48 180 top
SPI  47.62,38.1 270 top
STATUS_LED  37.47,13.97 90 top
U$1  9.53,31.11 0 top
U$2  12.7,45.72 90 top
U$11  39.37,48.26 0 top
U$20  33.02,20.32 135 top
U$27  53.34,59.69 180 top
U$30  26.67,64.77 0 top
U$31  1.27,71.12 0 top

### Tracks (layer width: path | path; a pad name or v marks a point on that pad's centre or on a via)
ARD_5V
  Top 0.254: JMP_0.1 JMP_0.2
  Bottom 0.254: U$27.5V 1.27,31.75 1.27,41.27 3.81,43.81 JMP_0.1
ARD_A0
  Top 0.254: JMP_7.3 JMP_7.4 JMP_10.1 JMP_10.2
  Bottom 0.254: U$27.A0 1.27,16.51 1.27,3.81 3.17,1.91 34.29,1.91 JMP_10.1
ARD_A1
  Top 0.254: JMP_9.3 JMP_9.4
  Bottom 0.254: U$27.A1 4.45,13.34 4.45,8.26 5.08,7.62 12.7,7.62 JMP_9.3
ARD_A2
  Top 0.254: JMP_3.4 JMP_3.3 JMP_16.3 JMP_16.4
  Bottom 0.254: U$27.A2 3.81,11.43 3.81,8.26 JMP_16.3
ARD_A4
  Top 0.254: JMP_5.4 JMP_5.3 JMP_17.3 JMP_17.4
  Bottom 0.254: U$27.A4 4.45,5.71 4.45,3.17 5.08,2.54 24.13,2.54 JMP_17.4
ARD_AREF
  Top 0.254: JMP_1.2 JMP_1.1
  Bottom 0.254: JMP_1.2 50.16,45.09 U$27.AREF
ARD_D0-RX
  Top 0.254: JMP_11.4 JMP_11.3 | JMP_11.4 JMP_4.1 JMP_4.2 | U$27.RX 50.8,4.45 48.9,2.54 34.92,2.54 JMP_11.4
ARD_D1-TX
  Top 0.254: JMP_2.2 JMP_2.1 12.7,1.91 49.53,1.91 52.07,4.45 52.07,6.35 U$27.TX
ARD_D3
  Top 0.254: JMP_15.3 JMP_15.4 JMP_6.1 JMP_6.2
  Bottom 0.254: U$27.D3 50.8,12.06 49.53,10.79 49.53,6.35 48.26,5.08 46.35,5.08 JMP_15.3
ARD_D5
  Top 0.254: JMP_13.3 JMP_13.4 JMP_8.1 JMP_8.2
  Bottom 0.254: U$27.D5 48.9,15.88 48.9,8.26 48.26,7.62 24.77,7.62 24.13,6.99 24.13,5.71 23.5,5.08 20.95,5.08 JMP_13.3
ARD_D7
  Top 0.254: JMP_12.2 JMP_12.1
  Bottom 0.254: JMP_12.2 24.13,8.26 24.13,9.53 24.77,10.16 46.35,10.16 46.35,12.06 48.26,13.97 48.26,20.32 U$27.D7
ARD_D8
  Top 0.254: JMP_14.2 JMP_14.1
  Bottom 0.254: U$27.D8 52.07,25.4 52.07,4.45 51.44,3.81 JMP_14.1
CHARGE_ENABLE  (via drill 0.38)
  Top 0.152: 20.32,27.94 v31.75,27.94 | R7.1 10.9,41.91 10.9,37.31 10.95,37.31
  Top 0.254: U$20.6 35.79,20.19 v36.04,20.19 | U$27.D4 50.16,14.61 v40.01,14.61 | 10.95,37.31 20.32,27.94
  Bottom 0.254: v40.01,14.61 36.04,18.57 v36.04,20.19 31.75,24.49 v31.75,27.94
CHARGE_STATUS  (via drill 0.38)
  Top 0.254: U$20.5 35.35,19.05 v43.81,19.05 | v19.05,15.24 32.38,15.24 34.92,12.7 40.01,12.7 40.64,13.34 v45.09,13.34 48.9,13.34 49.53,12.7 49.53,11.43 U$27.D2 | U$2.1 14.01,43.22 v13.97,43.18 13.97,41.67 12.6,40.3 11.48,40.3 R6.2
  Bottom 0.254: v43.81,19.05 45.09,17.78 v45.09,13.34 | v13.97,43.18 13.97,24.13 20.32,17.78 20.32,16.51 v19.05,15.24
GND  (via drill 0.38)
  Top 0.254: v25.98,46.41 IC7.PPAD | IC7.PPAD v27.36,46.41 | IC7.PPAD v27.36,45.03 | v25.98,45.03 IC7.PPAD | IC6.13 26.42,35.81 IC6.PAD | U$20.4 33.37,20.32 v33.02,20.32
  Top 0.406: v25.98,46.41 26.34,46.77 IC7.11
  Bottom 0.813: R23.2 29.32,45.72
  other vias: 26.67,45.72 26.67,35.56 27.94,64.77
  pour Top (isolate 0.254): 0,0 53.34,0 53.34,76.2 0,76.2
  pour Bottom (isolate 0.254): 53.34,0 0,0 0,76.2 53.34,76.2
I2C_SCL  (via drill 0.38)
  Top 0.152: 40.64,26.04 28.57,26.04 | v26.67,21.59 30.69,21.59
  Top 0.254: U$27.SCL 48.9,47.62 48.9,41.27 48.26,40.64 45.72,40.64 41.27,36.2 41.27,26.67 40.64,26.04 | U$30.7 26.32,67.02 26.67,66.67 26.67,62.87 27.02,62.52 U$30.3 28.17,60.73 29.21,59.69 v34.29,59.69 35.56,60.96 R27.1 | U$20.17 30.69,21.59 | 28.57,26.04 27.94,26.67 v26.67,26.67
  Bottom 0.254: v34.29,59.69 40.64,59.69 U$27.SCL | v26.67,26.67 v26.67,21.59
I2C_SDA  (via drill 0.38)
  Top 0.152: 40.64,25.4 v27.94,25.4
  Top 0.254: U$27.SDA 49.53,45.72 49.53,40.64 48.9,40.01 45.72,40.01 41.91,36.2 41.91,26.67 40.64,25.4 | U$30.8 23.2,67.02 23.5,67.31 23.5,68.58 24.13,69.22 29.21,69.22 29.84,68.58 29.84,62.87 30.19,62.52 U$30.4 34,62.52 v34.29,62.23 R34.1 | U$20.18 30.12,20.32 v27.94,20.32
  Bottom 0.254: v34.29,62.23 43.18,62.23 52.07,53.34 52.07,48.26 U$27.SDA | v27.94,20.32 v27.94,25.4
I_BATT
  Top 0.254: R1.1 40.02,51.97 U$11.4 40.85,49.11 41.27,49.53 R8.2
  Top 0.61: PWR_SWITCH.6 PWR_SWITCH.1 46.1,59.05 44.45,59.05 40.12,54.72 R1.1
MOTOR_A_BEMF  (via drill 0.38)
  Top 0.152: 30.98,24.13 v22.86,24.13
  Top 0.254: JMP_3.2 JMP_3.1 JMP_2.4 | JMP_2.3 JMP_2.4 | U$20.13 30.98,24.13 | R30.2 C41.1 v19.05,38.1 | JMP_2.4 10.79,13.97 20.95,24.13 v22.86,24.13
  Bottom 0.254: v22.86,24.13 22.86,34.29 v19.05,38.1
MOTOR_A_CURR  (via drill 0.38)
  Top 0.152: v21.59,22.86 30.83,22.86
  Top 0.254: JMP_16.1 JMP_16.2 | v20.95,32.38 20.32,33.02 R32.2 C43.1 | 30.83,22.86 U$20.15
  Bottom 0.254: v20.95,32.38 20.95,31.11 21.59,30.48 v21.59,22.86 21.59,15.88 19.68,13.97 8.26,13.97 JMP_16.1
MOTOR_A_IN1  (via drill 0.38)
  Top 0.152: 36.83,29.84 19.68,29.84
  Top 0.254: JMP_15.2 JMP_15.1 JMP_14.4 JMP_14.3 | IC7.14 23.8,46.05 v22.86,46.99 | U$20.9 v35.51,22.45 | v37.47,29.21 36.83,29.84 | 19.68,29.84 17.78,31.75 17.78,41.91 v20.95,45.09
  Bottom 0.254: v22.86,46.99 v20.95,45.09 | v37.47,29.21 37.47,26.04 35.56,24.13 35.56,22.51 v35.51,22.45 37.87,22.45 40.01,20.32 40.01,16.51 JMP_15.1
MOTOR_A_IN2  (via drill 0.38)
  Top 0.152: v38.73,28.57 36.83,28.57 | 36.2,29.21 19.68,29.21
  Top 0.254: IC7.13 24.43,46.7 v22.86,48.26 | U$20.10 34.75,22.4 34.75,22.76 35.48,23.5 v36.83,23.5 | U$27.D9 50.16,28.57 48.26,28.57 v40.64,20.95 | 36.83,28.57 36.2,29.21 | 19.68,29.21 17.14,31.75 17.14,42.55 v19.68,45.09
  Bottom 0.254: v22.86,48.26 v19.68,45.09 | v40.64,20.95 40.01,20.95 37.47,23.5 v36.83,23.5 38.1,24.77 38.73,25.4 v38.73,28.57
MOTOR_A_ISEN  (via drill 0.38)
  Top 0.254: IC6.3 25.92,32.91 v24.77,31.75
  Top 0.406: IC7.1 24.72,43.77
  Top 0.61: 24.72,43.77 v24.13,43.18
  Bottom 0.254: v24.13,43.18 24.13,32.38 v24.77,31.75
  Bottom 0.61: R21.1 v24.13,43.18
MOTOR_A_OUT1  (via drill 0.7)
  Top 0.254: R12.1 C24.1 21.59,40.64 v22.86,41.91
  Top 0.406: IC7.16 23.79,44.74
  Top 0.61: 23.79,44.74 22.86,43.81 v22.86,41.91
MOTOR_A_OUT2  (via drill 0.7)
  Top 0.254: v25.4,41.91 24.13,40.64 R13.1 23.34,39.85 22.38,38.89 C24.2
  Top 0.406: IC7.2 26.34,42.85 v25.4,41.91
MOTOR_B_BEMF  (via drill 0.38)
  Top 0.152: v34.29,27.3 v25.4,27.3
  Top 0.254: JMP_5.2 JMP_5.1 JMP_4.4 | JMP_4.3 JMP_4.4 | U$20.14 30.91,23.5 v25.4,23.5 | JMP_4.4 v30.48,13.97 | R31.2 C42.1 v34.29,38.1
  Bottom 0.254: v34.29,38.1 v34.29,27.3 | v25.4,27.3 v25.4,23.5 25.4,20.32 30.48,15.24 v30.48,13.97
MOTOR_B_CURR  (via drill 0.38)
  Top 0.152: v29.84,22.23 v23.5,22.23
  Top 0.254: JMP_17.2 JMP_17.1 v25.4,13.97 | U$20.16 30.76,22.23 v29.84,22.23 | v33.02,31.75 R33.2 C44.1 | v33.02,24.77 v29.84,24.77
  Bottom 0.152: 23.5,15.88 v23.5,22.23
  Bottom 0.254: v33.02,31.75 v33.02,24.77 | v29.84,24.77 v29.84,22.23 | v25.4,13.97 23.5,15.88
MOTOR_B_IN1  (via drill 0.38)
  Top 0.152: 36.2,15.88 38.73,15.88
  Top 0.254: U$27.D6 46.35,15.88 38.73,15.88 | U$20.1 33.02,17.42 v33.02,16.51 33.66,15.88 36.2,15.88 | IC7.7 29.52,46.05 v33.66,41.91
  Bottom 0.152: 30.48,36.83 30.48,19.05
  Bottom 0.254: v33.66,41.91 33.66,40.01 30.48,36.83 | 30.48,19.05 v33.02,16.51
MOTOR_B_IN2  (via drill 0.38)
  Top 0.254: JMP_13.2 JMP_13.1 JMP_12.4 JMP_12.3 | U$20.2 34.29,17.99 v34.29,17.14 | IC7.8 30.77,46.7 v34.29,43.18
  Bottom 0.152: 31.11,36.2 31.11,20.32
  Bottom 0.254: JMP_12.4 23.5,12.7 33.02,12.7 34.29,13.97 v34.29,17.14 31.11,20.32 | v34.29,43.18 34.92,42.55 34.92,40.01 31.11,36.2
MOTOR_B_ISEN  (via drill 0.38)
  Top 0.254: IC6.5 26.92,33.41 v28.57,31.75
  Top 0.406: IC7.4 28.62,43.77
  Top 0.61: 28.62,43.77 v29.21,43.18
  Bottom 0.254: v29.21,43.18 29.21,41.27 28.57,40.64 26.04,40.64 25.4,40.01 25.4,34.92 v28.57,31.75
  Bottom 0.61: R23.1 v29.21,43.18
MOTOR_B_OUT1  (via drill 0.7)
  Top 0.254: R16.1 C25.1 31.75,40.64 v30.48,41.91
  Top 0.406: IC7.5 29.55,44.74
  Top 0.61: v30.48,41.91 30.48,43.81 29.55,44.74
MOTOR_B_OUT2  (via drill 0.7)
  Top 0.254: v27.94,41.91 29.21,40.64 R17.1 30,39.85 30.96,38.89 C25.2
  Top 0.406: IC7.3 27,42.85 v27.94,41.91
N$1
  Top 0.61: PWR_SWITCH.2 48.9,56.52 | 48.9,56.52 PWR_SWITCH.5 | 48.9,56.52 48.9,53.98 45.72,50.8 45.72,45.35 PWR_BATT.V+
N$2
  Top 0.203: R2.1 9.53,33.66 | 9.53,33.66 R3.2 | U$1.8 9.53,33.66
N$3
  Top 0.203: R5.2 9.53,28.57 | 9.53,28.57 R4.1 | U$1.4 9.53,28.57
N$4
  Top 0.254: R7.2 11.91,43.33 11.39,43.85 U$2.5
N$5
  Top 0.254: IC7.9 28.62,47.67 29.21,48.26 C31.2
N$6
  Top 0.254: U$11.6 38.31,49.11 35.56,46.35 R28.2
N$7
  Top 0.254: PWR_LED1.A R36.2
N$8
  Top 0.254: R25.1 38.22,15.28 STATUS_LED.A
N$9
  Top 0.254: SPI.2 R40.1
N$10
  Top 0.254: SPI.3 R41.1
N$11
  Top 0.254: R42.1 SPI.4
N$18
  Top 0.254: IC7.12 24.72,47.67 24.13,48.26 C32.1
N$22
  Top 0.254: IC6.11 27.42,37.58 27.94,38.1 31.75,38.1 | 31.75,38.1 32.38,38.1 33.02,38.73 R16.2 | R18.1 31.75,38.1
N$23
  Top 0.254: IC6.12 26.92,37.87 R19.2 R17.2
N$24
  Top 0.254: 22.38,33.02 25.4,33.02 25.42,33.04 IC6.2 | 22.38,33.02 R22.1 | R20.2 22.38,33.02
N$26
  Top 0.254: IC6.6 27.42,33.54 27.94,33.02 31.11,33.02 | 31.11,33.02 31.75,33.66 R26.1 | R24.2 30.96,32.87 31.11,33.02
N$30
  Top 0.254: R12.2 21.11,38.1 21.59,38.1 | 21.59,38.1 25.09,38.1 25.43,37.77 IC6.15 | R14.1 21.59,38.1
N$31
  Top 0.254: IC6.14 25.92,38.37 R15.2 R13.2
N$34
  Top 0.254: IC6.7 30.2,34.01 30.96,34.77 R26.2 R33.1
N$35
  Top 0.254: R32.1 R22.2 23.65,34.77 24.41,34.01 IC6.1
N$36
  Top 0.254: IC6.16 23.77,37.11 23.01,36.35 R14.2 R30.1
N$37
  Top 0.254: IC6.10 30.2,37.11 30.96,36.35 R18.2 R31.1
RESET  (via drill 0.38)
  Top 0.152: 30.27,16.51 v17.78,16.51
  Top 0.254: U$20.23 30.27,16.51 | U$27.RES 1.27,34.29 1.27,22.23 2.54,20.95 R38.1 6.5,22.71 v6.35,22.86
  Bottom 0.254: v17.78,16.51 12.7,16.51 v6.35,22.86
SENSE_I_BATT  (via drill 0.38)
  Top 0.152: v35.56,28.57 v24.13,28.57 | 30.05,18.41 v24.13,18.41
  Top 0.254: JMP_9.2 JMP_9.1 JMP_8.4 | JMP_8.3 JMP_8.4 | R28.1 35.56,39.52 R29.2 C9.1 35.71,36.98 v35.56,36.83 | U$20.20 30.05,18.41 | JMP_8.4 16.51,16.51 18.41,18.41 v24.13,18.41
  Bottom 0.152: v24.13,28.57 v24.13,18.41
  Bottom 0.254: v35.56,36.83 v35.56,28.57
SENSE_V_BATT  (via drill 0.38)
  Top 0.152: 40.01,26.67 v29.21,26.67
  Top 0.254: R8.1 C3.1 R9.2 43.66,45.87 v43.81,45.72 | JMP_7.1 JMP_7.2 | JMP_6.3 JMP_6.4 JMP_7.1 | v44.45,40.64 40.64,36.83 40.64,27.3 40.01,26.67 | JMP_7.1 38.1,11.43 37.47,10.79 37.47,8.26 36.83,7.62 33.02,7.62 31.75,8.89 v31.75,13.97 | U$20.19 29.98,19.05 v29.21,19.05
  Bottom 0.152: v29.21,26.67 v29.21,19.05
  Bottom 0.254: v43.81,45.72 43.81,41.27 v44.45,40.64 | v31.75,13.97 31.75,16.51 v29.21,19.05
SENSE_V_BUS  (via drill 0.38)
  Top 0.254: R11.2 R10.1 C4.1 5.23,28.09 v5.08,27.94 | U$20.21 30.13,17.78 v26.67,17.78 | U$27.A5 4.45,6.99 4.45,7.62 | 4.45,7.62 26.04,7.62 26.67,8.26 v26.67,13.97 | 4.45,7.62 4.45,14.61 v5.08,15.24
  Bottom 0.254: v26.67,13.97 v26.67,17.78 | v5.08,15.24 v5.08,27.94
SPI_MISO  (via drill 0.38)
  Top 0.254: v44.45,31.75 44.6,31.6 R42.2 44.6,26.19 41.27,22.86 37.47,22.86 36.2,21.59 35.35,21.59 U$20.8
  Bottom 0.254: U$27.D12 52.07,35.56 52.07,33.66 51.44,33.02 50.16,33.02 48.9,31.75 v44.45,31.75
SPI_MOSI  (via drill 0.38)
  Top 0.254: v44.45,34.29 44.6,34.14 R41.2 43.81,33.02 43.18,32.38 43.18,25.4 41.27,23.5 38.1,23.5 37.31,24.28 35.08,24.28 34.29,23.5 34.29,22.65 U$20.11
  Bottom 0.254: U$27.D11 v44.45,34.29
SPI_SCK  (via drill 0.38)
  Top 0.254: v44.45,37.47 44.6,37.31 R40.2 43.81,35.56 42.55,34.29 42.55,25.4 41.27,24.13 38.1,24.13 37.47,24.77 34.92,24.77 33.66,23.5 33.66,22.72 U$20.12
  Bottom 0.254: U$27.D13 46.35,39.37 v44.45,37.47
SPI_SS
  Top 0.254: SPI.1 48.9,36.83 48.9,31.75 | 48.9,31.75 48.9,29.84 41.27,22.23 37.47,22.23 36.98,21.74 R35.1 36.91,20.89 U$20.7 | U$27.D10 48.9,31.75
SWD_CLK  (via drill 0.38)
  Top 0.152: 30.2,17.14 v19.05,17.14
  Top 0.254: U$20.22 30.2,17.14 | U$27.A3 1.27,11.43 1.27,18.41 2.54,19.68 R37.1 6.5,18.9 6.99,18.41 v12.7,18.41
  Bottom 0.254: v12.7,18.41 17.78,18.41 v19.05,17.14
SWD_DIO/STATUS  (via drill 0.38)
  Top 0.254: JMP_11.2 JMP_11.1 JMP_10.4 JMP_10.3 | U$20.24 31.75,17.28 31.75,16.51 34.29,13.97 v35.56,13.97 STATUS_LED.C 36.72,15.28 R39.1
  Bottom 0.254: JMP_10.4 35.56,12.06 v35.56,13.97
V_1.5  (via drill 0.38)
  Top 0.152: v32.38,41.27 36.2,41.27
  Top 0.254: U$1.1 7.77,32.52 R2.2 C6.1 7.77,35.71 v8.26,36.2 | R15.1 26.19,39.85 v26.67,39.37 27.15,39.85 R19.1 | U$11.1 38.52,47.41 v37.47,46.35 37.62,46.2 C11.2 37.62,42.7 36.2,41.27
  Bottom 0.254: v8.26,36.2 8.26,41.27 17.78,50.8 33.02,50.8 v37.47,46.35 | v26.67,39.37 30.48,39.37 v32.38,41.27
V_3.0  (via drill 0.38)
  Top 0.254: IC6.4 26.42,32.77 26.19,32.54 C29.1 26.19,30.63 26.04,30.48 | U$1.3 7.77,29.71 R4.2 C5.1 R36.1 7.62,25.88 v7.62,24.13 | JMP_1.3 JMP_1.4 | U$11.3 40.22,47.41 v41.27,46.35 41.12,46.2 C2.1 41.12,44.3 40.64,43.81 39.37,43.81 38.73,43.18 v38.73,39.37 | U$30.1 21.3,62.52 20.32,63.5 20.32,68.58 21.59,69.85 30.48,69.85 v31.11,69.22 31.11,67.08 U$30.5 32.67,67.02 33.02,66.67 33.02,66.04 33.81,65.25 R34.2 R27.2 | U$20.3 36.63,16.36 R39.2 R25.2 38.1,17.63 C10.1 v38.73,17.78 v41.27,17.78 | R35.2 37.95,20.32 v38.73,20.32 | v20.32,30.48 26.04,30.48 | 26.04,30.48 v38.73,30.48 | R37.2 R38.2 7.62,21.11 v7.62,24.13 | v15.88,30.48 15.88,27.3 12.7,24.13 v7.62,24.13
  Bottom 0.254: JMP_1.3 42.55,47.62 v41.27,46.35 31.11,56.52 v31.11,69.22 | v38.73,17.78 v38.73,20.32 | v41.27,17.78 41.91,18.41 41.91,27.3 v38.73,30.48 v38.73,39.37 | v20.32,30.48 v15.88,30.48
V_BATT
  Top 0.254: C31.1 27.9,50.01 C30.1 | U$11.5 39.37,50.16 38.62,50.91 R1.2 | IC7.15 22.55,45.4 21.59,46.35 21.59,52.07
  Top 0.406: IC7.10 27,48.59 27.42,49.01 C30.1
  Top 0.61: R1.2 27.94,52.07 | 27.94,52.07 21.59,52.07 15.24,52.07 | U$2.3 15.24,47.9 15.24,49.53 | 15.24,49.53 15.24,52.07 | 15.24,52.07 D1.A | C8.1 15.24,49.53 | C30.1 27.94,50.05 27.94,52.07
V_BUS
  Top 0.203: C1.1 11.58,31.6 11.1,31.11 U$1.6 U$1.2 8.26,31.11
  Top 0.254: 8.26,31.11 7.62,31.11 | 7.62,31.11 6.99,30.48 R10.2 | 8.89,41.91 JMP_0.3 JMP_0.4 5.71,33.66 7.62,31.75 7.62,31.11 | 8.89,41.91 8.89,46.99 9.8,47.9 10.16,47.9 | 8.89,41.91 10.42,40.38 R6.1
  Top 0.61: D1.C 10.16,52.07 | 10.16,52.07 7.89,52.07 PWR_BUS.2 | U$2.4 10.16,47.9 10.16,49.53 | 10.16,49.53 10.16,52.07 | C7.1 10.16,49.53

### Text on the board
tPlace: A1 | A2 | B1 | B2 | SPI_SS | SPI_SCK | SPI_MOSI | SPI_MISO